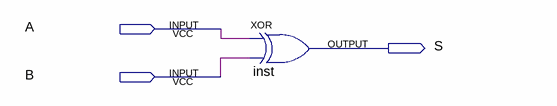
[diagram p0: schematic sheet]
// Quartus schematic Xor_entry.bdf as structural Verilog: 1 symbols, 3 pins
module Xor_entry (
  input  A,
  input  B,
  output S
);

  xor inst (S, A, B);
endmodule
